# EAGLE schematic circuito v1 (EAGLE 9.0.1)
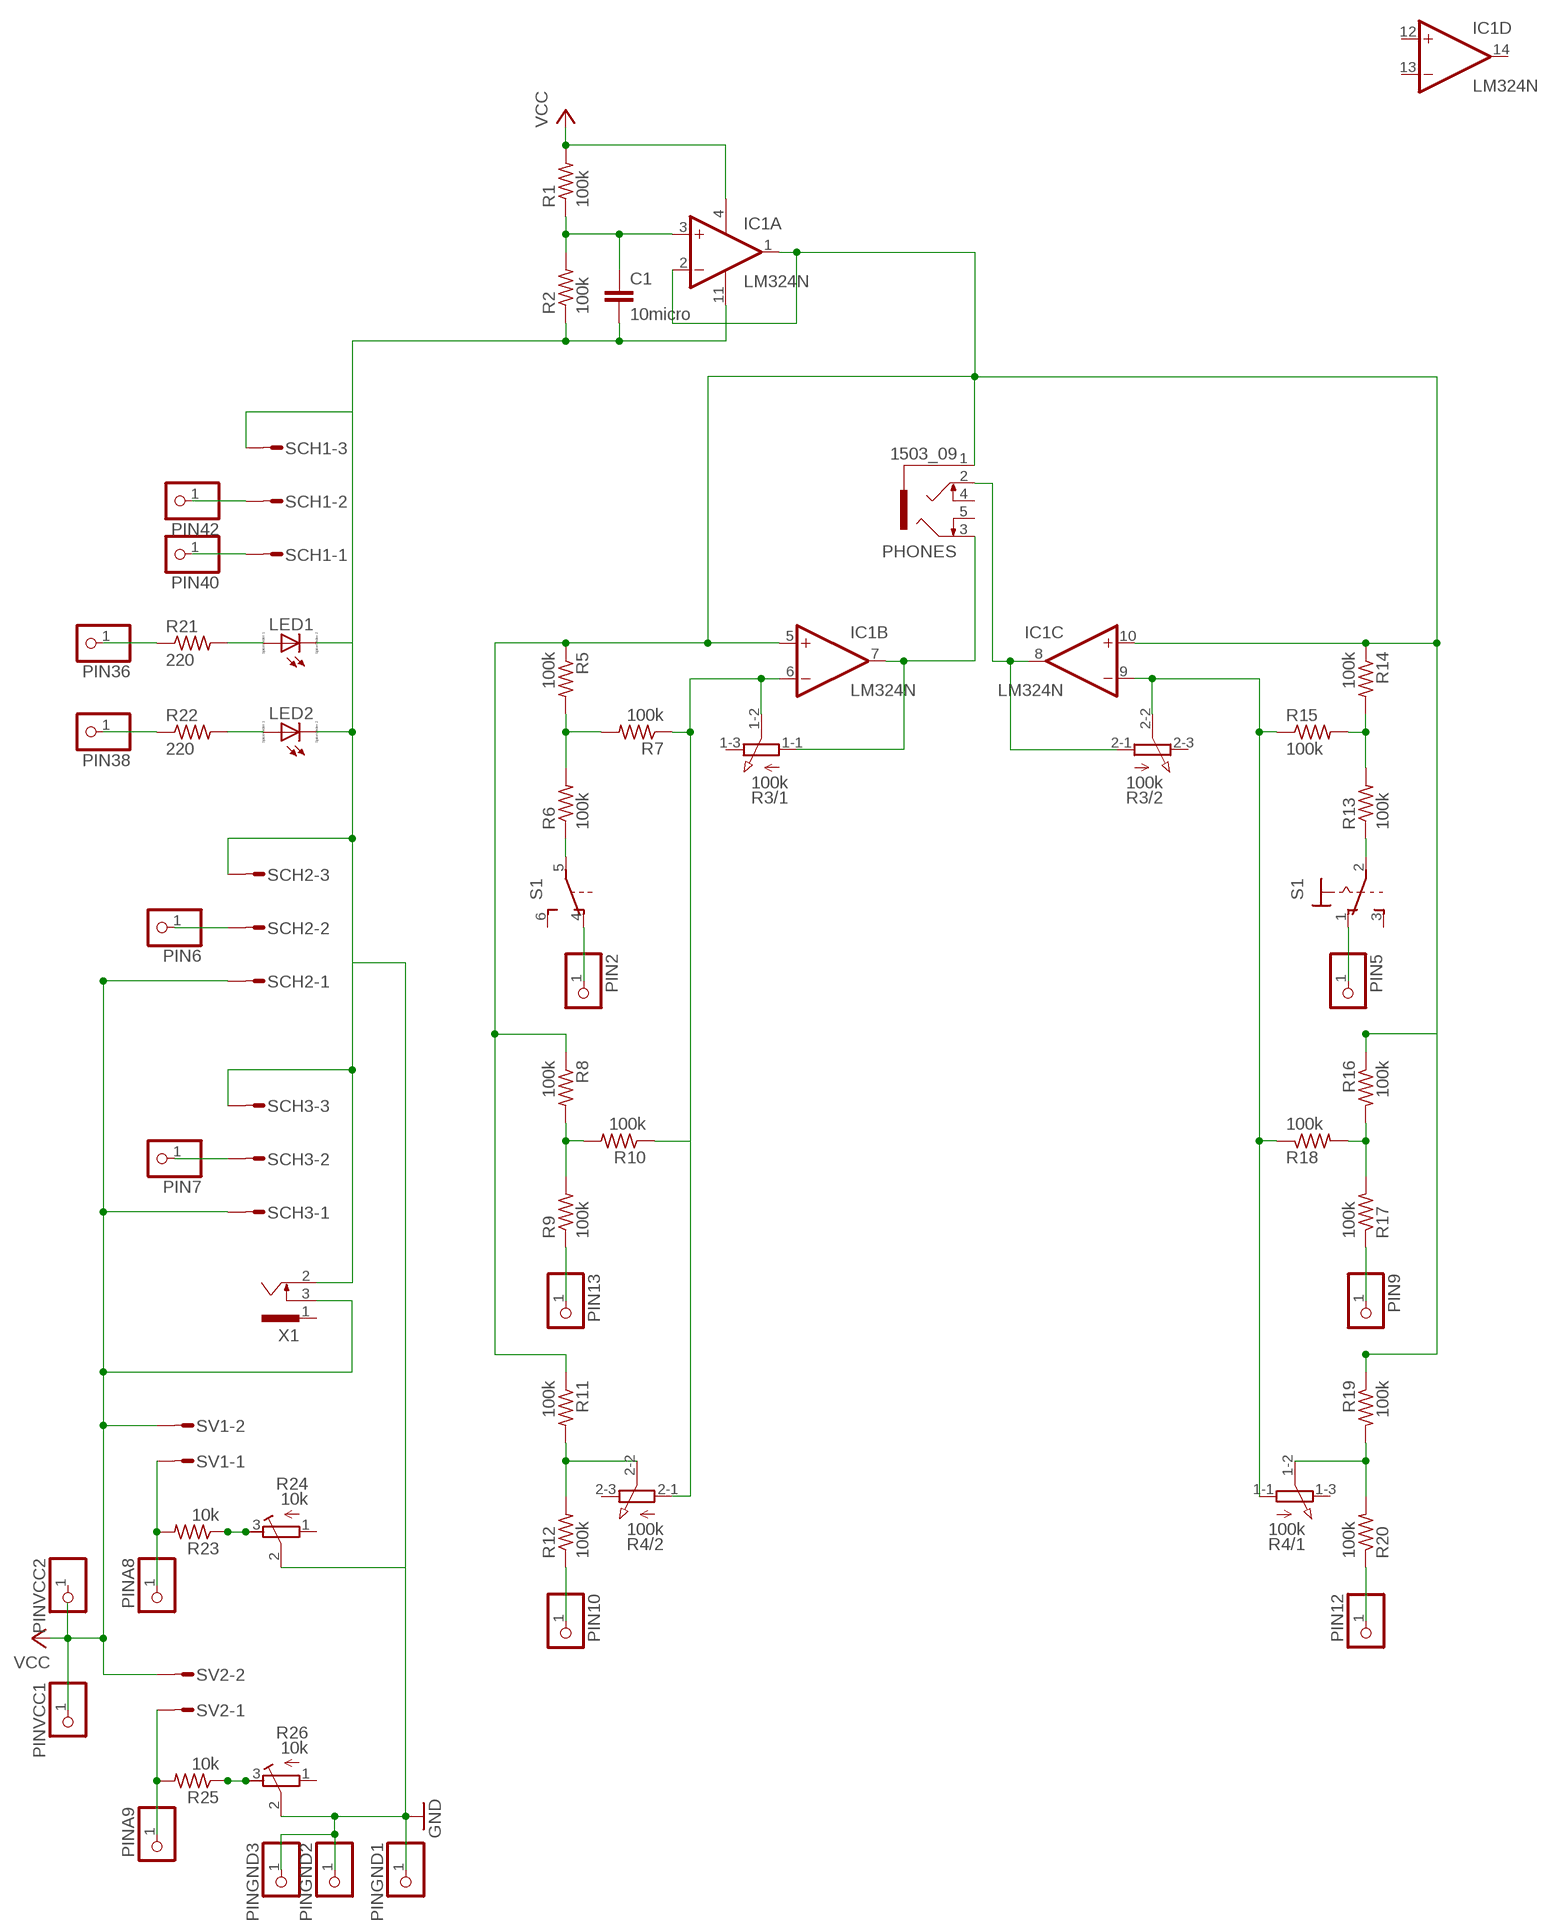
[diagram p0: schematic, sheet 1]

## Parts
C1  10micro  C-EU025-030X050  [C025-030X050]
IC1  LM324N  [DIL14]
LED1  LED_ELD260  [LED_LD260]
LED2  LED_ELD260  [LED_LD260]
PHONES  1503_09  [1503_09]
PIN2  PINHD-1X1  [1X01]
PIN5  PINHD-1X1  [1X01]
PIN6  PINHD-1X1  [1X01]
PIN7  PINHD-1X1  [1X01]
PIN9  PINHD-1X1  [1X01]
PIN10  PINHD-1X1  [1X01]
PIN12  PINHD-1X1  [1X01]
PIN13  PINHD-1X1  [1X01]
PIN36  PINHD-1X1  [1X01]
PIN38  PINHD-1X1  [1X01]
PIN40  PINHD-1X1  [1X01]
PIN42  PINHD-1X1  [1X01]
PINA8  PINHD-1X1  [1X01]
PINA9  PINHD-1X1  [1X01]
PINGND1  PINHD-1X1  [1X01]
PINGND2  PINHD-1X1  [1X01]
PINGND3  PINHD-1X1  [1X01]
PINVCC1  PINHD-1X1  [1X01]
PINVCC2  PINHD-1X1  [1X01]
R1  100k  R-US_0207/7  [0207/7]
R2  100k  R-US_0207/7  [0207/7]
R3  100k  3RP/1610G  [3RP/1610G]
R4  100k  3RP/1610G  [3RP/1610G]
R5  100k  R-US_0207/7  [0207/7]
R6  100k  R-US_0207/7  [0207/7]
R7  100k  R-US_0207/7  [0207/7]
R8  100k  R-US_0207/7  [0207/7]
R9  100k  R-US_0207/7  [0207/7]
R10  100k  R-US_0207/7  [0207/7]
R11  100k  R-US_0207/7  [0207/7]
R12  100k  R-US_0207/7  [0207/7]
R13  100k  R-US_0207/7  [0207/7]
R14  100k  R-US_0207/7  [0207/7]
R15  100k  R-US_0207/7  [0207/7]
R16  100k  R-US_0207/7  [0207/7]
R17  100k  R-US_0207/7  [0207/7]
R18  100k  R-US_0207/7  [0207/7]
R19  100k  R-US_0207/7  [0207/7]
R20  100k  R-US_0207/7  [0207/7]
R21  220  R-US_0207/7  [0207/7]
R22  220  R-US_0207/7  [0207/7]
R23  10k  R-US_0207/7  [0207/7]
R24  10k  R-TRIMM64W  [RTRIM64W]
R25  10k  R-US_0207/7  [0207/7]
R26  10k  R-TRIMM64W  [RTRIM64W]
S1  320-938  [320-938]
SCH1  L03P  [L03P]
SCH2  L03P  [L03P]
SCH3  L03P  [L03P]
SV1  L02P  [L02P]
SV2  L02P  [L02P]
X1  SCD-014A  [SCD-014-A]

## Nets
GND: PINGND1.1 PINGND2.1 PINGND3.1 R24.2(S) R26.2(S)
N$1: C1.1 IC1.3(A:+IN) R1.1 R2.2
N$2: IC1.1(A:OUT) IC1.2(A:-IN) IC1.5(B:+IN) IC1.10(C:+IN) PHONES.1 R5.1 R8.1 R11.1 R14.1 R16.1
N$4: IC1.6(B:-IN) R3.1-2(/1:S) R4.2-1(/2:A) R7.1
N$5: R5.2 R6.2 R7.2
N$6: R6.1 S1.5(B:P)
N$7: PIN2.1 S1.4(B:O)
N$8: R10.1
N$9: R8.2 R9.2 R10.2
N$10: PIN13.1 R9.1
N$11: R4.2-2(/2:S) R11.2 R12.2
N$12: PIN10.1 R12.1
N$13: IC1.9(C:-IN) R3.2-2(/2:S) R4.1-1(/1:A) R15.1 R18.1
N$14: R13.2 R14.2 R15.2
N$15: R13.1 S1.2(1:P)
N$16: PIN5.1 S1.1(1:O)
N$17: R19.1
N$18: R4.1-2(/1:S) R19.2 R20.2
N$19: R16.2 R17.2 R18.2
N$20: PIN9.1 R17.1
N$21: PIN12.1 R20.1
N$22: PIN42.1 SCH1.2
N$23: PIN40.1 SCH1.1
N$24: LED1.A R21.2
N$25: PIN36.1 R21.1
N$26: LED2.A R22.2
N$27: PIN38.1 R22.1
N$28: PIN7.1 SCH3.2
N$29: PIN6.1 SCH2.2
N$30: IC1.8(C:OUT) PHONES.2 R3.2-1(/2:A)
N$31: PINA8.1 R23.2 SV1.1
N$32: R23.1 R24.3(E)
N$33: SV2.2
N$34: PINA9.1 R25.2 SV2.1
N$35: R25.1 R26.3(E)
N$36: C1.2 IC1.11(P:V-) LED1.K(C) LED2.K(C) R2.1 SCH1.3 SCH2.3 SCH3.3 X1.2
N$37: IC1.7(B:OUT) PHONES.3 R3.1-1(/1:A)
VCC: IC1.4(P:V+) PINVCC1.1 R1.2 SCH2.1 SCH3.1 SV1.2 X1.3
Unconnected: IC1.12(D:+IN) IC1.13(D:-IN) IC1.14(D:OUT) PHONES.4 PHONES.5 PINVCC2.1 R3.1-3(/1:E) R3.2-3(/2:E) R4.1-3(/1:E) R4.2-3(/2:E) R24.1(A) R26.1(A) S1.3(1:S) S1.6(B:S) X1.1

## Library data of the parts
C1 = rcl:C-EU: CAPACITOR, European symbol; SPICEPREFIX: C
IC1 = linear:LM324: OP AMP
LED1 LED2 = eagle-ltspice:LED_E: LED Source: http://www.osram.convergy.de Source: www.luxeon.com Source: www.kingbright.com; SPICEMODEL: NONE; SPICEPREFIX: D; SPICETYPE: diode
PHONES = con-lumberg:1503_09: Jack connectors according to JISC 6560, 3.5 mm Klinkeneinbaukupplung nach JISC 6560, 3,5 mm, 3-polig/ stereo, abgewinkelte Ausführung, mit 2 Öffnern und Lötaugen, für Leiterplatten Rückseitenmontage Source: http://www.lumberg.com/Produkte/PDFs/1503_09.pdf; OC_FARNELL: 1243244; OC_NEWARK: unknown
PIN2 PIN5-PIN7 PIN9 PIN10 PIN12 PIN13 PIN36 PIN38 PIN40 PIN42 PINA8 PINA9 PINGND1-PINGND3 PINVCC1 PINVCC2 = pinhead:PINHD-1X1: PIN HEADER
R1 R2 R5-R23 R25 = rcl:R-US_: RESISTOR, American symbol; SPICEPREFIX: R
R3 R4 = pot:3RP/1610G: 16mm Potentiometer two level Source: http://www.alphapotentiometers.net/html/16mm_pot_2.html
R24 R26 = rcl:R-TRIMM: Trimm resistor; SPICEMODEL: X; SPICEPREFIXL: POT
S1 = switch:320-938: TOGGLE SWITCH distributor RS Components
SCH1-SCH3 = con-amp-mt:L03P: AMP MT CONNECTOR; OC_FARNELL: unknown; OC_NEWARK: unknown
SV1 SV2 = con-amp-mt:L02P: AMP MT CONNECTOR; OC_FARNELL: unknown; OC_NEWARK: unknown
X1 = con-shiua-chyuan:SCD-014A: Power Jack 2.5mm; OC_FARNELL: unknown; OC_NEWARK: unknown